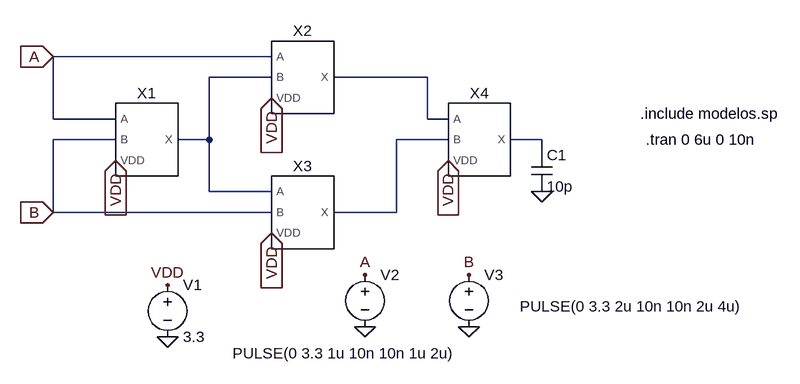
[diagram p0: schematic XOR_2IN_1MA.asc]
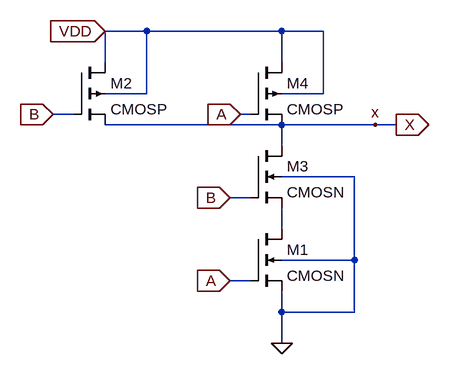
[diagram p1: sub-circuit nand1ma_2in_simb.asc]
XOR_2IN_1MA.asc, the LTspice schematic file:
Version 4
SHEET 1 1000 680
WIRE 192 48 -144 48
WIRE 192 80 96 80
WIRE 432 80 288 80
WIRE -144 144 -144 48
WIRE -48 144 -144 144
WIRE 432 144 432 80
WIRE 464 144 432 144
WIRE -48 176 -144 176
WIRE 96 176 96 80
WIRE 96 176 48 176
WIRE 464 176 384 176
WIRE 608 176 560 176
WIRE 608 192 608 176
WIRE 96 256 96 176
WIRE 192 256 96 256
WIRE -144 288 -144 176
WIRE 192 288 -144 288
WIRE 384 288 384 176
WIRE 384 288 288 288
FLAG 464 208 VDD
IOPIN 464 208 In
FLAG 192 112 VDD
IOPIN 192 112 In
FLAG -48 208 VDD
IOPIN -48 208 In
FLAG 192 320 VDD
IOPIN 192 320 In
FLAG 32 400 VDD
FLAG 32 480 0
FLAG 608 256 0
FLAG 336 464 0
FLAG 336 384 A
FLAG 496 464 0
FLAG 496 384 B
FLAG -144 48 A
IOPIN -144 48 In
FLAG -144 288 B
IOPIN -144 288 In
SYMBOL NAND1mA_2IN_SIMB 0 176 R0
SYMATTR InstName X1
SYMBOL NAND1mA_2IN_SIMB 240 80 R0
SYMATTR InstName X2
SYMBOL NAND1mA_2IN_SIMB 240 288 R0
SYMATTR InstName X3
SYMBOL NAND1mA_2IN_SIMB 512 176 R0
SYMATTR InstName X4
SYMBOL voltage 32 384 R0
WINDOW 123 0 0 Left 0
WINDOW 39 0 0 Left 0
SYMATTR InstName V1
SYMATTR Value 3.3
SYMBOL cap 592 192 R0
SYMATTR InstName C1
SYMATTR Value 10p
SYMBOL voltage 336 368 R0
WINDOW 3 -204 137 Left 2
WINDOW 123 0 0 Left 0
WINDOW 39 0 0 Left 0
SYMATTR InstName V2
SYMATTR Value PULSE(0 3.3 1u 10n 10n 1u 2u)
SYMBOL voltage 496 368 R0
WINDOW 3 78 65 Left 2
WINDOW 123 0 0 Left 0
WINDOW 39 0 0 Left 0
SYMATTR InstName V3
SYMATTR Value PULSE(0 3.3 2u 10n 10n 2u 4u)
TEXT 760 136 Left 2 !.include modelos.sp
TEXT 768 176 Left 2 !.tran 0 6u 0 10n

nand1ma_2in_simb.asc, the sub-circuit schematic file:
Version 4
SHEET 1 1484 824
WIRE 224 -240 160 -240
WIRE 432 -240 224 -240
WIRE 496 -240 432 -240
WIRE 160 -192 160 -240
WIRE 432 -192 432 -240
WIRE 224 -144 224 -240
WIRE 224 -144 160 -144
WIRE 496 -144 496 -240
WIRE 496 -144 432 -144
WIRE 112 -112 80 -112
WIRE 384 -112 368 -112
WIRE 432 -96 160 -96
WIRE 576 -96 432 -96
WIRE 608 -96 576 -96
WIRE 432 -64 432 -96
WIRE 544 -16 432 -16
WIRE 384 16 352 16
WIRE 432 64 432 32
WIRE 544 112 544 -16
WIRE 544 112 432 112
WIRE 384 144 352 144
WIRE 432 192 432 160
WIRE 544 192 544 112
WIRE 544 192 432 192
WIRE 432 240 432 192
FLAG 432 240 0
FLAG 80 -112 B
IOPIN 80 -112 In
FLAG 576 -96 x
FLAG 368 -112 A
IOPIN 368 -112 In
FLAG 352 16 B
IOPIN 352 16 In
FLAG 352 144 A
IOPIN 352 144 In
FLAG 608 -96 X
IOPIN 608 -96 Out
FLAG 160 -240 VDD
IOPIN 160 -240 In
SYMBOL nmos4 384 64 R0
SYMATTR InstName M1
SYMATTR Value CMOSN
SYMATTR Value2 l=0.6u w=4.2u
SYMBOL pmos4 112 -192 R0
SYMATTR InstName M2
SYMATTR Value CMOSP
SYMATTR Value2 l=.6u w=11.6u
SYMBOL nmos4 384 -64 R0
SYMATTR InstName M3
SYMATTR Value CMOSN
SYMATTR Value2 l=0.6u w=4.2u
SYMBOL pmos4 384 -192 R0
SYMATTR InstName M4
SYMATTR Value CMOSP
SYMATTR Value2 l=.6u w=11.6u

The netlist it stands for:
* XOR_2IN_1MA.asc
XX1 A B VDD N001 nand1ma_2in_simb
XX2 A N001 VDD N002 nand1ma_2in_simb
XX3 N001 B VDD N003 nand1ma_2in_simb
XX4 N002 N003 VDD N004 nand1ma_2in_simb
V1 VDD 0 3.3
C1 N004 0 10p
V2 A 0 PULSE(0 3.3 1u 10n 10n 1u 2u)
V3 B 0 PULSE(0 3.3 2u 10n 10n 2u 4u)

* block symbol definitions
.subckt nand1ma_2in_simb A B VDD X
M1 N001 A 0 0 CMOSN l=0.6u w=4.2u
M2 VDD B x VDD CMOSP l=.6u w=11.6u
M3 x B N001 0 CMOSN l=0.6u w=4.2u
M4 VDD A x VDD CMOSP l=.6u w=11.6u
.ends nand1ma_2in_simb

.model NMOS NMOS
.model PMOS PMOS
.lib standard.mos
.include modelos.sp
.tran 0 6u 0 10n
.backanno
.end

* Results of the author's LTspice run, read from the files saved beside the schematic
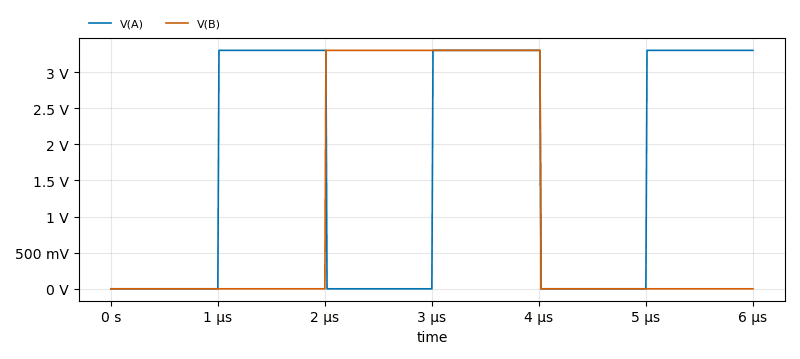
[diagram p2: Transient Analysis of XOR_2IN_1MA.asc, plotted from the saved traces]
* Transient Analysis, 1 run:
*   V(A): min 0 V, max 3.3 V, average 1.658 V, rms 2.336 V, last 3.3 V
*   V(B): min 0 V, max 3.3 V, average 1.105 V, rms 1.908 V, last 0 V